# EasyEDA Pro project ProPrj_MOSSE_2026-03-25.epro, schematic Schematic3
Board Name: Board3; Create Date: 2026-03-15; Page Name: P1; Project Name: MOSSE; Schematic Name: Schematic3; Update Date: 2026-03-15; Company: EasyEDA.com; Page Size: A4; Version: V1.0
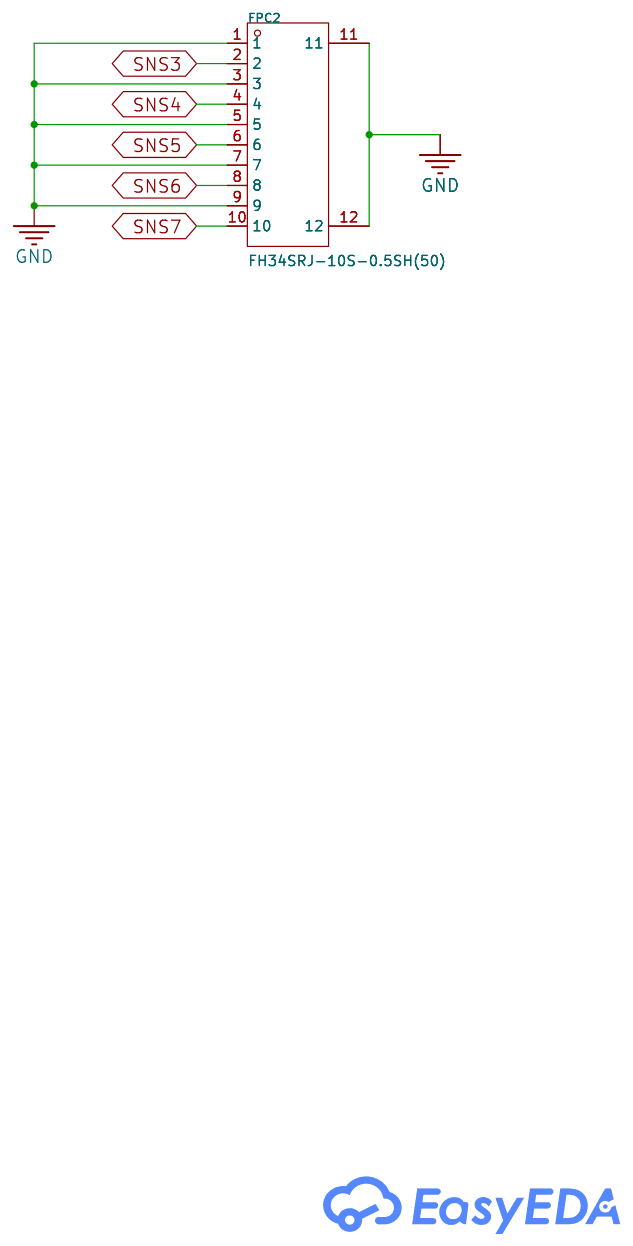
[diagram p6: schematic sheet]

## Parts
FPC2  FH34SRJ-10S-0.5SH(50)  [FFC-SMD_10P-P0.50_FH34SRJ-10S-0.5SH]

## Library data of the parts
FPC2 = FH34SRJ-10S-0.5SH(50): Locking Feature:- Contact Type:Double-Sided Contacts, Top and Bottom Entry Number of Contacts:10P Pitch:0.5mm Mounting Type:Surface Mount, Right Angle FFC, FCB Thickness:0.3mm FFC, FCB Thickness:0.3mm Height Above Board:1mm Contact Material:Phosphor Bronz; LCSC Part Name: 间距:0.5mm P数:10P 双侧触点/上下接; Supplier Part: C324723; Manufacturer: HRS(广濑); Supplier Footprint: SMD,P=0.5mm,卧贴; JLCPCB Part Class: Extended Part; Datasheet: https://item.szlcsc.com/datasheet/FH34SRJ-10S-0.5SH(50)/305533.html; Supplier: LCSC; Contact Type: Double-Sided Contacts, Top and Bottom Entry; Number of Contacts: 10P; Pitch: 0.5mm; Mounting Type: Surface Mount, Right Angle; FFC, FCB Thickness: 0.3mm; Height Above Board: 1mm; Contact Material: Phosphor Bronze; Contact Plating: Gold; Operating Temperature: -55℃~+105℃

## Nets
GND: FPC2.1 FPC2.3 FPC2.5 FPC2.7 FPC2.9 FPC2.11 FPC2.12
SNS3: FPC2.2
SNS4: FPC2.4
SNS5: FPC2.6
SNS6: FPC2.8
SNS7: FPC2.10
